# Altium schematic sheet Boost-converter.SchDoc
size A4; SheetNumber: 3; SheetTotal: 6
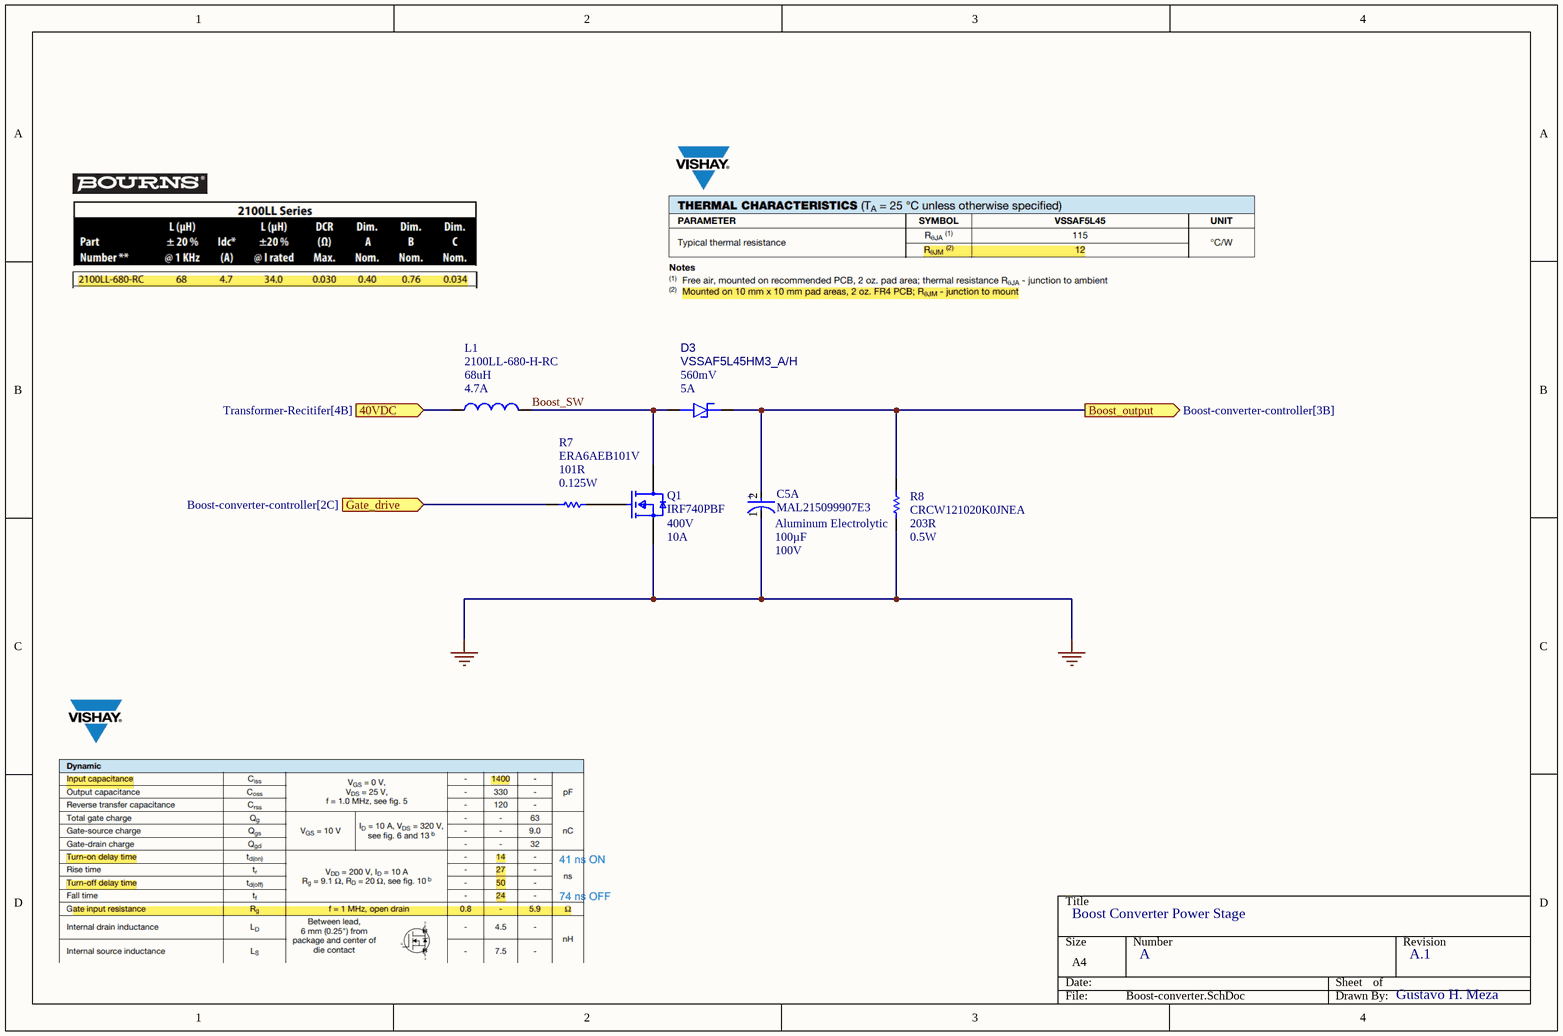
[diagram p0: Boost-converter.SchDoc]

## Parts
C5  MAL215099907E3  Voltage Rating: 100V  Capacitance: 100µF  Construction: Aluminum Electrolytic  [FP-MAL215099907E3-MFG]  (part A of 2)
D3  VSSAF5L45HM3_A/H  Forward Current: 5A  Forward Voltage: 560mV  [VSSAF5L45HM3_A_H-Footprint-1]
L1  2100LL-680-H-RC  Inductance-Nom (L): 68uH  Max Current Rating: 4.7A  [2100LL-680-H-RC-Footprint-1]
Q1  IRF740PBF  Drain To Source Voltage: 400V  Continuous Drain Current: 10A  [FP-X15-0364-MFG]
R7  ERA6AEB101V  Resistance: 101R  Power rating: 0.125W  [RESC2013X60X40ML20T25]
R8  CRCW121020K0JNEA  Resistance: 203R  Power: 0.5W  [RESC3225X60X45NL20T20]

## Ports
40VDC (in, see Transformer-Recitifer[4B]), Boost_output (out, see Boost-converter-controller[3B]), Gate_drive (in, see Boost-converter-controller[2C])

## Nets
GND: C5.1(C) Q1.3(S) R8.1
40VDC: L1.1 ; port 40VDC
Boost_output: C5.2(A) D3.1(K) R8.2 ; port Boost_output
Boost_SW: D3.2(A) L1.2 Q1.2(D)
Gate_drive: R7.1 ; port Gate_drive
NetQ1_1: Q1.1(G) R7.2

## Notes on the sheet
- Boost Converter Power Stage
- A
- A.1
- Gustavo H. Meza
- (in symbol CMP-00030-68114016-1, part A) +

## Library data of the parts
C5 = CMP-00030-68114016-1: MAL215099907E3 Cap Aluminum 100uF 100V 20% (12.5 X 13mm) Cylindrical 660mA 5000 hr 105°C Blister T/R; Dissipation Factor: 10%; Polarity: Polar; Life (Hours): 3000hours; Leakage Current: 100µA; Impedance: 350mΩ; Packaging: Tape & Reel (TR); NexarPartId: 68114016; Case/Package: Radial; Mount: Surface Mount; Voltage Rating (DC): 100V; Height - Seated (Max): 13.97mm; Max Operating Temperature: 105°C; Height: 14mm; RoHS: Compliant; Tolerance: 20%; Ripple Current: 660mA; Min Operating Temperature: -40°C
D3 = CMP-004-00033-2: Diode Schottky 45V 5A DO221AC; Diode Element Material: SILICON; Diode Type: RECTIFIER; Application(s): EFFICIENCY; Min Operating Temperature: -40°C; Max Operating Temperature: 150°C; Pins: 2; RoHS Compliant: Yes
L1 = CMP-006-00025-1: General Purpose Inductor, 68uH, 15%, 1 Element; Inductor Application: HIGH CURRENT INDUCTOR; DC Resistance (DCR): 30mR; Construction: Horizontal Mounting; RoHS Compliant: Yes; Tolerance: 15%; Max Operating Temperature: 125°C; Pins: 2; Min Operating Temperature: -55°C
Q1 = CMP-02550-000088-1: MOSFET N-CH 400V 10A TO-220AB; Manufacturer: Vishay; Power Dissipation: 125W; Turn On Delay Time: 14ns; Standoff Height: 3.33mm; Max Junction Temp: +150°C; Number Of Channels: 1; Reverse Recovery Charge: 3800nC; Turn Off Delay Time: 50ns; Threshold Vgs Min: 2V; Input Capacitace At Vds: 1400pF @ 25V; Depletion Mode: False; Gate Charge At Vgs: 63nC @ 10V; Rthja Max: 62°C/W; Threshold Vgs Max: 4V; Gate To Source Voltage: 20V; Pulse Drain Current: 40A; Reverse Recovery Time: 370ns; Drain To Source Resistance: 0.55Ω; Temperature Range Low: -55°C; Mouser Description: MOSFET N-Chan 400V 10 Amp; Package: X15-0364; RoHS: TRUE; Manufacturer Part Number: IRF740PBF; Category: Trans; Drain To Source Breakdown Voltage: 400V; Device Class L3: MOSFETs; Lead Free: Yes; Height: 19.89mm; Octopart: https://octopart.com/irf740pbf-vishay-46527100; Automotive: No; Max Forward Diode Voltage: 2V; Device Class L1: Discrete Semiconductors; ComponentLink2URL: http://www.vishay.com/docs/91054/91054.pdf; Temperature Range High: +150°C; Device Class L2: Transistors; ComponentLink2Description: Datasheet; Temperature: -55°C to +150°C; Number Of N Channels: 1; Digikey Description: MOSFET N-CH 400V 10A TO-220AB
R7 = CMP-2001-00580-1: Manufacturer: Panasonic; Part Number: ERA6AEB101V
R8 = CMP-2005-02060-1: Manufacturer: Vishay Dale; Part Number: CRCW121020K0JNEA